# EAGLE board Arduino_fuer_LEDs_DCC_1.8.2 (EAGLE 9.6.2)
RELEASE_DATE: 21.12.22; RELEASE_VER: 1.8.2
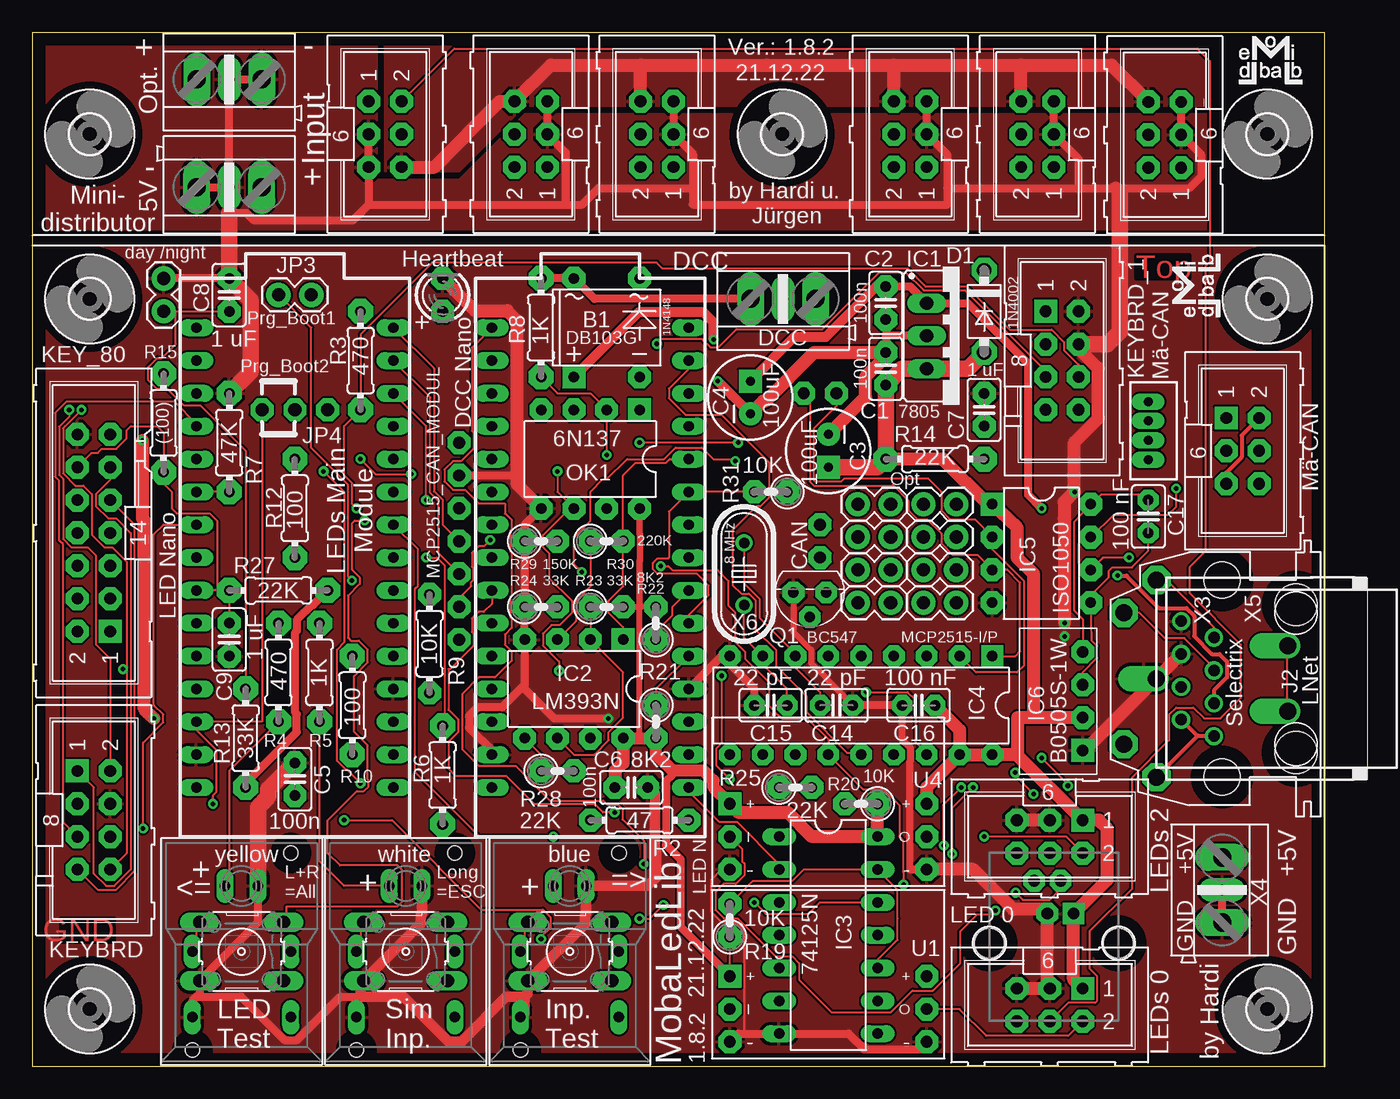
[diagram p2: board, top side]
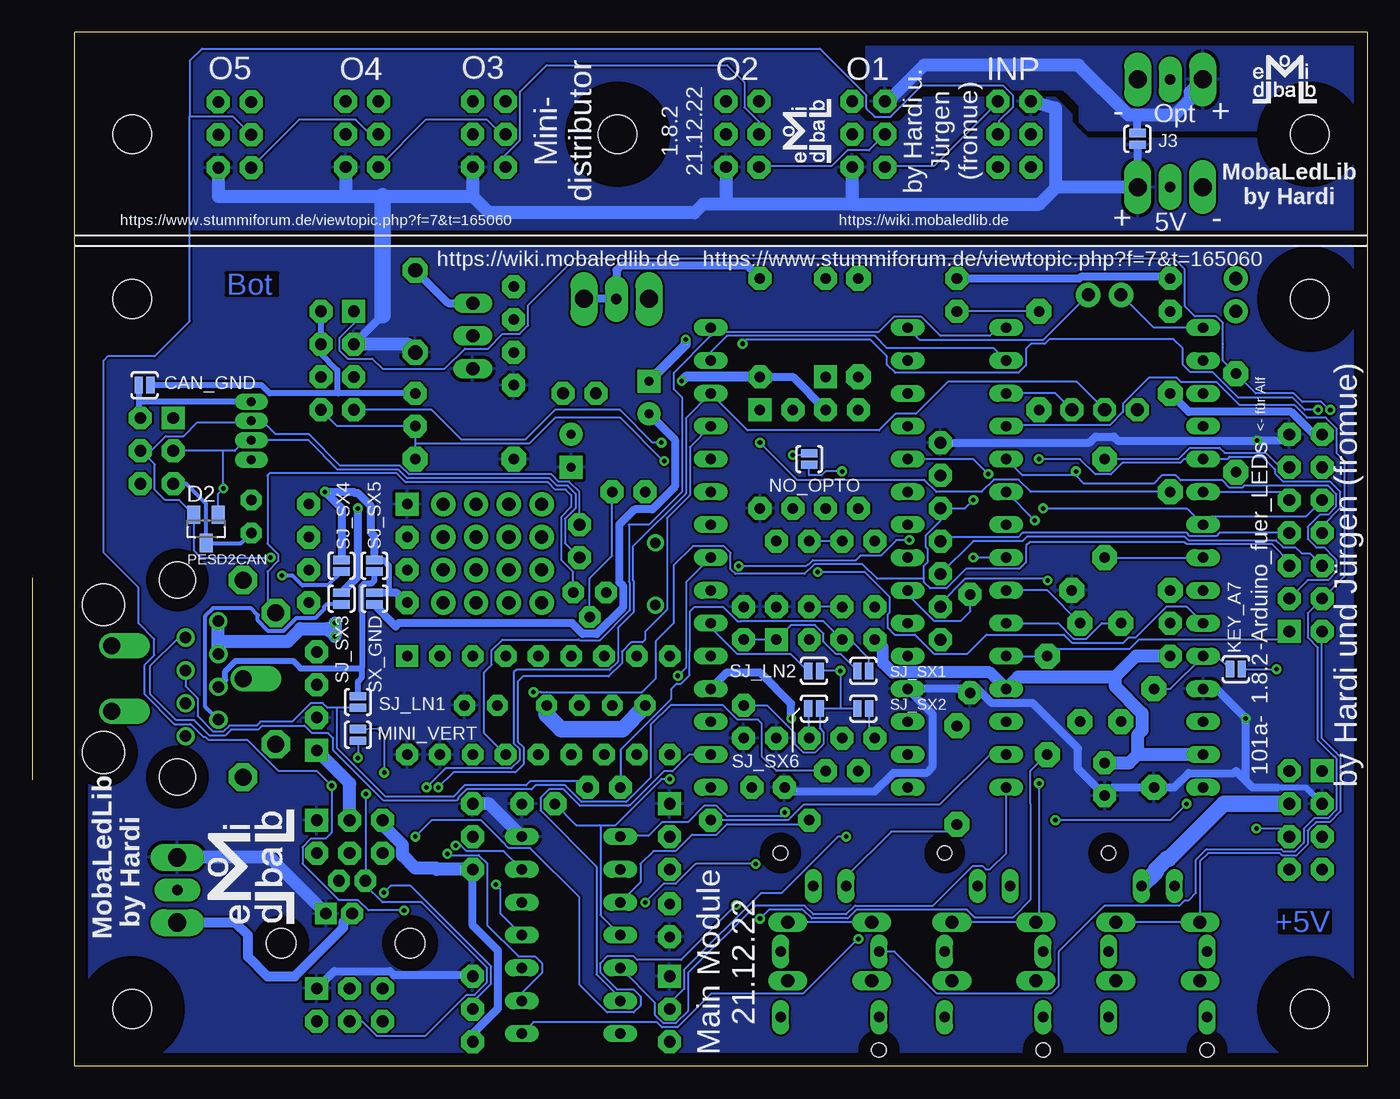
[diagram p3: board, bottom side, seen from below]

Size 100 x 80 mm. Coordinates in mm from the lower left corner, seen from the top.
Outline: 0,80 0,0 100,0 100,80 0,80
Copper layers (1*16): Top 0.035mm / dielectric 1.5mm / Bottom 0.035mm
Design rules "default *": minimum track width 6mil, minimum drill 0.35mm, track to track 6mil, track to pad 6mil, pad to pad 6mil, via to via 6mil, smd to smd 6mil, copper to edge 40mil, drill to drill 6mil, minimum pad ring 10mil, minimum via ring 8mil, stop-mask expansion 4mil, vias tented up to drill 0.5mm, thermal gap 10mil

## Footprints (pad centres in the part's own frame; a part is rotated, then mirrored left to right if it is on the bottom)
1X02 = drill 1.016 pad 1.88: 1 0,0; 2 2.54,0
DB = drill 0.813 pad 1.778 square: + -2.54,-3.81 | drill 0.813 pad 1.778 octagon: - 2.54,-3.81; AC1 2.54,3.81; AC2 -2.54,3.81
C025-025X050 = drill 0.813 pad 1.778 octagon: 1 -1.27,0; 2 1.27,0
SPARKFUN-CAPACITORS_CPOL-RADIAL-100UF-25V = drill 0.7 pad 1.778 square: 1 1.27,0 | drill 0.7 pad 1.778: 2 -1.27,0
C2.5-2 = drill 0.813 pad 1.6 octagon: 1 -1.27,0; 2 1.27,0
MCP2515_CAN_MODUL = drill 0.914 pad 1.778 octagon: 1 0,0; 2 0,-2.54; 3 0,-5.08; 4 0,-7.62; 5 0,-10.16; 6 0,-12.7; 7 0,-15.24; 8 27.94,-6.35; 9 27.94,-8.89; 10 26.67,3.81; 11 29.21,3.81
SJ_2S-NO = smd 0.635 x 1.27: 1 -0.45,0; 2 0.45,0
B4B-ZR4P = drill 0.7 pad 1.27 long: 1 0,0; 2 1.5,0; 3 3,0; 4 4.5,0
DO41-10 = drill 1.118 pad 1.93 octagon: A 3.175,0; C -3.175,0
SOT23 = smd 1 x 1.4: 1 -0.95,-1.1; 2 0.95,-1.1; 3 0,1.1
3,0 = hole 3: 0,0
78XXS = drill 1.016 long: GND 0,-2.54; IN -2.54,-2.54; OUT 2.54,-2.54
DIL08 = drill 0.813 pad 1.778 square: 1 -3.81,-3.81 | drill 0.813 pad 1.778 octagon: 2 -1.27,-3.81; 3 1.27,-3.81; 4 3.81,-3.81; 5 3.81,3.81; 6 1.27,3.81; 7 -1.27,3.81; 8 -3.81,3.81
DIL14 = drill 0.813 long: 1 -7.62,-3.81; 2 -5.08,-3.81; 3 -2.54,-3.81; 4 0,-3.81; 5 2.54,-3.81; 6 5.08,-3.81; 7 7.62,-3.81; 8 7.62,3.81; 9 5.08,3.81; 10 2.54,3.81; 11 0,3.81; 12 -2.54,3.81; 13 -5.08,3.81; 14 -7.62,3.81
DIL18 = drill 0.813 pad 1.676 square: 1 -10.16,-3.81 | drill 0.813 pad 1.676 octagon: 2 -7.62,-3.81; 3 -5.08,-3.81; 4 -2.54,-3.81; 5 0,-3.81; 6 2.54,-3.81; 7 5.08,-3.81; 8 7.62,-3.81; 9 10.16,-3.81; 10 10.16,3.81; 11 7.62,3.81; 12 5.08,3.81; 13 2.54,3.81; 14 0,3.81; 15 -2.54,3.81; 16 -5.08,3.81; 17 -7.62,3.81; 18 -10.16,3.81
DCDC-TEA_NME = drill 0.9 pad 1.778 square: G_IN 0,0 | drill 0.9 pad 1.778 octagon: G_OUT 5.08,0; V_IN 2.54,0; V_OUT 7.62,0
ML6 = drill 0.914 pad 1.778 octagon: 1 -2.54,-1.27; 2 -2.54,1.27; 3 0,-1.27; 4 0,1.27; 5 2.54,-1.27; 6 2.54,1.27
RJ11-NO_SHIELD_NO_MOUNT_HOULE = drill 0.9 pad 1.4: 1 -3.175,8.89; 2 -1.905,6.35; 3 -0.635,8.89; 4 0.635,6.35; 5 1.905,8.89; 6 3.175,6.35
1X03-CLEANBIG = drill 1.016 pad 1.778 octagon: 1 -2.54,0; 2 0,0; 3 2.54,0
ML14 = drill 0.914 pad 1.778 square: 1 -7.62,-1.27 | drill 0.914 pad 1.778 octagon: 2 -7.62,1.27; 3 -5.08,-1.27; 4 -5.08,1.27; 5 -2.54,-1.27; 6 -2.54,1.27; 7 0,-1.27; 8 0,1.27; 9 2.54,-1.27; 10 2.54,1.27; 11 5.08,-1.27; 12 5.08,1.27; 13 7.62,-1.27; 14 7.62,1.27
CON-HARTING-ML_ML08 = drill 0.914 pad 1.778 square: 1 -5.08,-1.27 | drill 0.914 pad 1.778 octagon: 2 -5.08,1.27; 3 -2.54,-1.27; 4 -2.54,1.27; 5 0,-1.27; 6 0,1.27; 7 2.54,-1.27; 8 2.54,1.27
LED3MM = drill 0.813 pad 1.778 octagon: A -1.27,0; K 1.27,0
TO92 = drill 0.813 pad 1.676 octagon: 1 1.27,0; 2 0,1.905; 3 -1.27,0
0204/7 = drill 0.813 pad 1.778 octagon: 1 -3.81,0; 2 3.81,0
0204/7' = drill 0.813 pad 1.93 octagon: 1 -3.81,0; 2 3.81,0
0207/2V = drill 0.813 pad 1.778 octagon: 1 -1.27,0; 2 1.27,0
B3F-10XX = drill 1.016 long: 1 -3.251,2.261; 2 3.251,2.261; 3 -3.251,-2.261; 4 3.251,-2.261
SRKL = drill 0.813 long: 1 -3.81,-5.08; 2 -3.81,0; 3 3.81,0; 4 3.81,-5.08; + -1.27,5.08; - 1.27,5.08 | hole 1.118: 3.81,7.62; -3.81,-7.62
ML6' = drill 0.914 pad 1.778 square: 1 -2.54,-1.27 | drill 0.914 pad 1.778 octagon: 2 -2.54,1.27; 3 0,-1.27; 4 0,1.27; 5 2.54,-1.27; 6 2.54,1.27
WS2812__BREAKOUT = drill 0.914 pad 1.778 square: 1 -7.62,2.54 | drill 0.914 pad 1.778 octagon: 2 -7.62,0; 3 -7.62,-2.54; 4 7.62,-2.54; 5 7.62,0; 6 7.62,2.54
NANO = drill 0.8 long: 3.3V -10.16,24.13; 5V -10.16,-1.27; A0 -10.16,19.05; A1 -10.16,16.51; A2 -10.16,13.97; A3 -10.16,11.43; A4 -10.16,8.89; A5 -10.16,6.35; A6 -10.16,3.81; A7 -10.16,1.27; AREF -10.16,21.59; D2 5.08,1.27; D3 5.08,3.81; D4 5.08,6.35; D5 5.08,8.89; D6 5.08,11.43; D7 5.08,13.97; D8 5.08,16.51; D9 5.08,19.05; D10 5.08,21.59; D11 5.08,24.13; D12 5.08,26.67; D13 -10.16,26.67; GND -10.16,-6.35; GND1 5.08,-1.27; RAW -10.16,-8.89; RST -10.16,-3.81; RST1 5.08,-3.81; RX1 5.08,-6.35; TX0 5.08,-8.89
RJ10 = drill 0.9 pad 1.676 square: 1 -1.524,-2.3 | drill 0.9 pad 1.676 octagon: 2 -0.508,-4.84; 3 0.508,-2.3; 4 1.524,-4.84 | hole 2.3: 5,0; -5,0
AK500/2+M = drill 1.397 long: 1 -2.515,0; 2 2.515,0 | drill 0.813 pad 1.778 long: M 0,0
MAB5SH = drill 1.321 pad 2.184 octagon: 1 7.62,5.08; 3 -7.62,5.08; 4 5.08,7.62; 5 -5.08,7.62 | drill 1.321 pad 1.626 offset: 2 0,5.08 | drill 1.321 offset: PE -2.54,-5.08; PE@ 2.54,-5.08 | hole 2.794: 7.62,0; -7.62,0
RJ45_MEBP8-8S = drill 0.889: 1 -4.445,6.35; 2 -3.175,8.89; 3 -1.905,6.35; 4 -0.635,8.89; 5 0.635,6.35; 6 1.905,8.89; 7 3.175,6.35; 8 4.445,8.89 | hole 3.251: -5.715,0; 5.715,0
HC49U-V = drill 0.813: 1 -2.413,0; 2 2.413,0

## Placement (x,y rotation side)
A1  Opt  [1X02]  63.88,35.88 0 top
A2  Opt  [1X02]  68.96,35.88 0 top
A3  Opt  [1X02]  68.96,38.42 0 top
A4  Opt  [1X02]  63.88,38.42 0 top
A5  Opt  [1X02]  68.96,40.96 0 top
A6  Opt  [1X02]  63.88,40.96 0 top
A7  Opt  [1X02]  68.96,43.5 0 top
A8  Opt  [1X02]  63.88,43.5 0 top
B1  DB103G  [DB]  44.45,57.15 0 top
C1  100n  [C025-025X050]  66.04,53.98 90 top
C2  100n  [C025-025X050]  66.04,59.05 270 top
C3  100uF  [SPARKFUN-CAPACITORS_CPOL-RADIAL-100UF-25V]  61.59,47.62 270 top
C4  100uF  [SPARKFUN-CAPACITORS_CPOL-RADIAL-100UF-25V]  55.56,51.75 90 top
C5  100n  [C025-025X050]  20.32,22.23 90 top
C6  100n  [C025-025X050]  46.35,21.59 0 top
C7  1 uF  [C025-025X050]  73.66,50.8 90 top
C8  1 uF  [C025-025X050]  15.24,59.69 90 top
C9  1 uF  [C025-025X050]  15.24,33.02 270 top
C14  22 pF  [C2.5-2]  62.23,27.94 0 top
C15  22 pF  [C2.5-2]  57.15,27.94 180 top
C16  100 nF  [C2.5-2]  68.58,27.94 180 top
C17  100 nF  [C2.5-2]  86.36,42.55 270 top
CAN2  MCP2515_CAN_MODUL  [MCP2515_CAN_MODUL]  33.02,48.26 0 top
CAN_GND  SOLDERJUMPERNO  [SJ_2S-NO]  94.61,52.7 0 bottom
CON5  M04B4B-ZR4P  [B4B-ZR4P]  86.36,51.44 270 top
D1  1N4002  [DO41-10]  73.66,58.42 270 top
D2  PESD2CAN  [SOT23]  89.85,41.59 180 bottom
H1  MOUNT-HOLE3.0  [3,0]  4.45,4.45 0 top
H2  MOUNT-HOLE3.0  [3,0]  4.45,59.37 0 top
H3  MOUNT-HOLE3.0  [3,0]  95.57,59.37 0 top
H4  MOUNT-HOLE3.0  [3,0]  95.57,4.45 0 top
H5  MOUNT-HOLE3.0  [3,0]  4.45,72.12 0 top
H6  MOUNT-HOLE3.0  [3,0]  95.57,72.12 0 top
H7  MOUNT-HOLE3.0  [3,0]  58.02,72.12 0 top
IC1  7805  [78XXS]  71.75,56.52 270 top
IC2  LM393N  [DIL08]  41.91,29.21 180 top
IC3  74125N  [DIL14]  61.59,10.16 270 top
IC4  MCP2515-I/P  [DIL18]  64.14,27.94 180 top
IC5  ISO1050  [DIL08]  78.11,39.69 270 top
IC6  B0505S-1W  [DCDC-TEA_NME]  81.28,24.45 90 top
INP  [ML6]  27.3,72.12 270 top
J1  day /night  [1X02]  10.16,60.96 270 top
J2  LNet  [RJ11-NO_SHIELD_NO_MOUNT_HOULE]  97.79,30 90 top
J3  SOLDERJUMPERNO  [SJ_2S-NO]  17.78,71.75 90 bottom
JP3  Prg_Boot1  [1X02]  21.59,59.69 180 top
JP4  Prg_Boot2  [1X03-CLEANBIG]  20.32,50.8 0 top
KEY_80  [ML14]  4.76,41.27 90 top
KEY_A7  SOLDERJUMPERNO  [SJ_2S-NO]  10.16,30.73 0 bottom
KEYBRD  [CON-HARTING-ML_ML08]  4.76,17.78 270 top
KEYBRD_1  [CON-HARTING-ML_ML08]  79.69,53.34 270 top
LED1  Heartbeat  [LED3MM]  31.75,59.69 90 top
MINI_VERT  SOLDERJUMPERNO  [SJ_2S-NO]  78.11,25.65 90 bottom
NO_OPTO  SOLDERJUMPERNO  [SJ_2S-NO]  43.18,46.99 90 bottom
O1  [ML6]  38.59,72.12 90 top
O2  [ML6]  48.34,72.12 90 top
O3  [ML6]  67.94,72.12 90 top
O4  [ML6]  77.79,72.12 90 top
O5  [ML6]  87.63,72.07 90 top
OK1  6N137  [DIL08]  43.18,46.99 180 top
Q1  BC547  [TO92]  60.17,36.67 180 top
R2  47  [0204/7]  46.99,19.05 0 top
R3  470  [0204/7']  25.4,54.61 270 top
R4  470  [0204/7']  19.05,30.48 90 top
R5  1K  [0204/7']  22.23,30.48 90 top
R6  1K  [0204/7']  31.75,22.54 90 top
R7  47K  [0204/7']  15.24,48.26 270 top
R8  1K  [0204/7']  39.37,57.15 90 top
R9  10K  [0204/7]  30.73,32.7 270 top
R10  100  [0204/7']  24.77,27.94 90 top
R12  100  [0204/7']  20.32,43.18 90 top
R13  33K  [0204/7']  16.51,25.4 270 top
R14  22K  [0204/7']  69.85,46.99 180 top
R15  (100)  [0204/7']  10.16,49.78 90 top
R19  10K  [0207/2V]  53.98,11.3 90 top
R20  10K  [0207/2V]  64.14,20.32 180 top
R21  8K2  [0207/2V]  48.26,26.67 270 top
R22  8K2  [0207/2V]  48.26,34.29 90 top
R23  33K  [0207/2V]  44.45,35.56 0 top
R24  33K  [0207/2V]  39.37,35.56 0 top
R25  22K  [0207/2V]  59.05,21.59 0 top
R27  22K  [0204/7']  19.05,36.83 0 top
R28  22K  [0207/2V]  40.64,22.86 0 top
R29  150K  [0207/2V]  39.37,40.64 0 top
R30  220K  [0207/2V]  44.45,40.64 0 top
R31  10K  [0207/2V]  57.15,44.45 180 top
S1  [B3F-10XX]  16.19,8.89 180 top
S2  [B3F-10XX]  28.89,8.89 180 top
S3  [B3F-10XX]  41.59,8.89 180 top
S4  yellow  [SRKL]  16.19,8.89 0 top
S5  white  [SRKL]  28.89,8.89 0 top
S6  blue  [SRKL]  41.59,8.89 0 top
SJ_LN1  SOLDERJUMPERNO  [SJ_2S-NO]  78.11,28.19 270 bottom
SJ_LN2  SOLDERJUMPERNO  [SJ_2S-NO]  42.8,30.61 180 bottom
SJ_SX1  SOLDERJUMPERNO  [SJ_2S-NO]  38.99,30.61 180 bottom
SJ_SX2  SOLDERJUMPERNO  [SJ_2S-NO]  38.99,27.69 180 bottom
SJ_SX3  SOLDERJUMPERNO  [SJ_2S-NO]  79.38,36.2 90 bottom
SJ_SX4  SOLDERJUMPERNO  [SJ_2S-NO]  79.38,38.73 90 bottom
SJ_SX5  SOLDERJUMPERNO  [SJ_2S-NO]  76.83,38.73 90 bottom
SJ_SX6  SOLDERJUMPERNO  [SJ_2S-NO]  42.8,27.69 0 bottom
SV1  Mä-CAN  [ML6']  93.66,47.62 270 top
SV2  LEDs 2  [ML6']  78.74,17.78 180 top
SV3  LEDs 0  [ML6']  78.74,4.76 180 top
SX_GND  SOLDERJUMPERNO  [SJ_2S-NO]  76.83,36.2 90 bottom
U1  WS2812_BREAKOUT  [WS2812__BREAKOUT]  61.59,4.45 0 top
U2  LED NANO  [NANO]  22.86,30.48 0 top
U3  DCC NANO  [NANO]  45.72,30.48 0 top
U4  WS2812_BREAKOUT  [WS2812__BREAKOUT]  61.59,17.78 0 top
U$1  ESP_ADAPTER  [ESP_ADAPTER]  12.7,21.59 0 top
X1  RJ10  [RJ10]  79.06,9.53 180 top
X2  AK500/2+M  [AK500/2+M]  58.1,59.37 180 top
X3  MAB 5SH Conrad: 738247 - VQ  [MAB5SH]  92.08,30 90 top
X4  AK500/2+M  [AK500/2+M]  92.08,13.65 90 top
X5  Reichelt MEBP 8-8S  [RJ45_MEBP8-8S]  97.79,30 90 top
X6  8 MHz  [HC49U-V]  55.09,38.1 270 top
X7  AK500/2+M  [AK500/2+M]  15.24,76.35 180 top
X9  AK500/2+M  [AK500/2+M]  15.24,68.02 0 top

## Tracks (layer width: path | path; a pad name or v marks a point on that pad's centre or on a via)
+5V  (via drill 0.35)
  Top 0.152: U1.1 R19.1
  Top 0.457: 46.99,25.4 46.99,35.56 | R22.2 46.99,35.56 | R23.2 46.99,35.56
  Top 0.508: OK1.8 46.99,41.2 47.02,41.18 47.02,39.13 46.99,39.11 46.99,35.56
  Top 0.61: R27.2 21.74,35.71 21.64,35.71 20.47,34.55 20.47,33.7 20.32,33.55 20.32,27.41 20.47,27.26 20.47,25.87 16.51,21.91 R13.2 | 49.53,22.86 49.53,22.55 49.03,22.05 49.03,17.14 50.16,16.02 50.16,10.79 U1.1
  Top 0.914: U4.1 52.72,21.58 52.72,22.11 51.97,22.86 49.53,22.86 48.26,24.13 R21.2 46.99,25.4 IC2.8
  Top 1.016: C16.1 71.75,26.04 IC4.17 | IC4.17 IC4.18 76.2,24.13 | U4.1 54.66,19.63 58.46,19.63 60.31,17.78 IC3.14 R20.1 | C6.1 45.09,22.86 45.72,23.5 IC2.8 | R14.2 70.48,46.99 73.98,43.5 IC5.1 76.17,41.7 76.2,41.67 76.2,39.37 77.47,38.1 77.47,26.99 | IC6.V_IN 77.47,26.99 | 77.47,26.99 76.24,26.99 76.24,24.17 76.2,24.13 | 76.2,24.13 SV2.1 82.55,19.05 83.19,18.41 83.19,14.43 X1.1 80.58,6.73 SV3.1 | U4.6 69.22,21.59 IC4.17 | v8.51,48.42 8.51,42.38 8.67,42.22 8.67,27.65 v9.4,26.92
  Top 1.27: C3.1 65.41,46.35 R14.2 C1.1 67.31,53.98 IC1.OUT 72.39,53.98 D1.A
  Bottom 0.152: 79.06,67.67 79.1,67.67 78.87,67.31
  Bottom 0.457: KEYBRD.3 4.76,21.59 6.99,21.59
  Bottom 0.61: CAN2.1 21.49,48.26 21.04,48.72 19.61,48.72 19.31,48.42 v8.51,48.42 6.51,48.42 KEY_80.13 | U2.5V 11.68,29.21 v9.4,26.92 9.4,22.1 | 9.4,22.1 10.16,22.86 10.32,22.7 13.81,22.7 14.93,21.59 R13.2 19.68,21.59 C5.1 22.38,23.02 22.38,24.61 25.88,28.1 29.05,28.1 30.44,29.48 R9.2 30.8,29.21 U3.5V 33.66,27.3 33.66,23.18 34.13,22.7 36.67,22.7 38.1,21.27 44.77,21.27 C6.1 | 9.4,22.1 8.89,21.59 6.99,21.59 | SV3.1 79.93,7.38 75.64,7.38 75.32,7.05 69.28,7.05 U1.6 | J3.1 17.78,69.85 17.75,69.88 X9.2 | KEYBRD_1.3 76.2,58.1
  Bottom 1.016: X1.1 84.92,16.17 X4.2 | IC3.14 67.94,20.32 U4.6 | D1.A 74.3,55.88 KEYBRD_1.3 | 39.86,66.71 25.36,66.71 24.13,67.94 | 78.87,67.31 76.2,67.31 69.22,67.31 | 39.86,66.71 49.62,66.71 | INP.1 24.13,74.14 24.13,67.94 | O1.1 39.86,66.71 | O2.1 49.62,66.71 | O3.1 69.22,67.31 | O4.1 79.06,67.67 79.06,67.31 88.9,67.31 O5.1 | X9.2 24.05,68.02 24.13,67.94 | 49.62,66.71 51.4,66.71 52.07,66.04 67.94,66.04 69.22,67.31
  Bottom 1.27: 76.2,58.1 76.2,67.31
  pour Bottom: 0,62.23 1.27,63.5 1.91,63.5 97.16,63.5 100.33,60.33 100.33,2.54 97.79,0 1.91,0 0,1.91 0,2.54
  pour Bottom: 0,71.75 21.59,71.75 22.23,72.39 22.86,73.03 22.86,73.66 24.13,74.93 34.29,74.93 36.2,73.03 36.83,73.03 38.73,73.03 39.37,73.66 39.37,80.01 99.69,80.01 99.69,64.77 0,64.77
A1  (via drill 0.35)
  Top 0.152: v25.4,46.99 26.56,45.83 v29.32,45.83
  Bottom 0.152: v29.32,45.83 30.48,46.99 U3.A1 | v25.4,46.99 22.23,46.99 21.03,45.8 19.83,45.8 18.94,46.69 14.48,46.69 14.17,46.99 U2.A1 10.83,46.99 10.65,47.17 8.1,47.17 7.15,46.22 7.15,45.89 6.5,45.24 2.86,45.24 2.07,44.45 2.07,43.23 3.49,41.8 KEY_80.8
A7
  Top 0.152: J1.2 11.11,58.42 | 11.11,58.42 C8.1 | R13.1 16.51,47.62 13.02,51.12 11.75,51.12 10.47,52.4 9.67,52.4 8.97,53.1 8.97,54.09 9.67,54.79 10.02,54.79 11.11,55.88 11.11,58.42
  Bottom 0.152: R13.1 15.24,29.21 U2.A7 11.63,31.75 KEY_A7.1
BUTTONS  (via drill 0.35)
  Top 0.152: KEYBRD.7 5.08,13.65 6.35,13.65 6.36,13.66 6.48,13.66 7.94,15.13 7.94,41.91 KEY_80.9 | R7.2 U2.A2 | v54.61,48.26 52.43,48.26 49.21,48.26 v46.99,48.26
  Bottom 0.152: KEY_80.9 6.67,44.45 U2.A2 | R7.2 26.04,44.45 26.99,45.4 28.89,45.4 29.84,44.45 33.34,44.45 34.29,45.4 44.13,45.4 v46.99,48.26 | v54.61,48.26 55.3,48.26 57.84,50.8 62.87,50.8 65.18,48.49 70.08,48.49 72.39,50.8 KEYBRD_1.7
CAN_H  (via drill 0.35)
  Top 0.152: IC5.7 83.69,42.67 87.88,42.67 88.52,43.31 v88.52,44.7
  Bottom 0.152: CAN2.9 62.08,40.49 62.08,42.37 61.27,43.19 61.27,44.32 61.87,44.93 62.7,44.93 63.26,45.49 74.28,45.49 74.97,46.18 79.66,46.18 81.92,48.44 CON5.3 86.82,48.44 87.63,47.62 88.52,47.62 | 88.52,47.62 SV1.3 | 88.52,47.62 v88.52,44.7 88.9,44.32 D2.1
CAN_L  (via drill 0.35)
  Top 0.152: v84.86,39.37 82.83,39.37 82.77,39.31 82.77,39.27 IC5.6
  Bottom 0.152: 94.49,47.24 94.79,47.55 SV1.4 94.49,47.24 | 94.49,47.24 92.96,48.77 91.59,48.77 90.53,49.84 86.41,49.84 CON5.2 85.5,49.94 84.45,48.9 81.89,48.9 79.48,46.48 74.84,46.48 74.15,45.8 63.14,45.8 62.58,45.24 61.75,45.24 60.96,44.45 CAN2.8 | 94.49,47.24 93.81,46.57 93.81,44.6 93.03,43.81 91.92,43.81 D2.2 90.8,39.92 90.25,39.37 v84.86,39.37
CAN_VCC
  Top 0.152: C17.1 85.83,44.21 82.69,44.21 IC5.8 80.61,42.11 80.61,35.29 81.28,34.61 IC6.V_OUT
CLOCK_K
  Top 0.152: U2.A0 12.7,49.74 11,51.44 2.63,51.44 1.76,50.57 1.76,45.63 2.07,45.33 2.07,40.69 2.38,40.38 2.38,18.9 KEYBRD.5
D2
  Bottom 0.152: KEY_80.1 6.67,33.02 17.67,33.02 18.4,32.28 24.23,32.28 R10.2 U2.D2
D2_2  (via drill 0.35)
  Top 0.152: v40.64,46.04 40.64,44.45 OK1.6 41.6,43.18 39.52,41.1 39.52,40.18 40.01,39.69 40.01,37.78 41.76,36.02 41.76,35.1 40.8,34.14 40.18,34.14 39.52,33.48 39.52,32.56 40.77,31.31 v40.77,30.61 | U3.D2 48.26,29.21 R21.1
  Bottom 0.152: v40.64,46.04 41.91,46.04 42.23,45.72 43.18,45.72 NO_OPTO.1 | SJ_SX2.2 40.77,27.69 | 40.77,27.69 SJ_SX6.2 42.35,26.15 42.06,25.86 42.06,24.94 42.72,24.28 43.64,24.28 44.33,24.96 44.33,25.81 46.45,27.94 R21.1 | SJ_LN2.1 v40.77,30.61 40.77,27.69
D3
  Bottom 0.152: R4.2 20.54,34.29 21.73,33.1 22.72,33.1 23.91,34.29 U2.D3
D4
  Bottom 0.152: R5.2 24.77,36.83 U2.D4
D5  (via drill 0.35)
  Top 0.152: R6.2 31.9,26.5 31.9,38.79 31.32,39.37 v30.48,39.37
  Bottom 0.152: U2.D5 v30.48,39.37
D6  (via drill 0.35)
  Top 0.152: U2.D6 29.84,40.01 29.84,37.2 29.62,36.98 29.62,22.77 34.61,17.78 v40.32,17.78
  Bottom 0.152: U1.2 53.98,4.88 52.86,6 52.86,7.47 46.92,13.41 45.34,13.41 40.97,17.78 v40.32,17.78
D7  (via drill 0.35)
  Top 0.152: S4.2 12.7,9.21 12.7,11.11 S1.4 | S1.3 19.68,11.43 19.68,12.38 28.26,12.38 28.57,12.7 28.57,15.24 28.26,15.56 23.81,15.56 22.86,16.51 22.86,19.05 25.11,21.3 25.65,21.3 26.01,21.66 26.01,22.16 25.96,22.21 25.96,24.84 24.89,25.91 24.89,30.19 25.96,31.26 25.96,32.24 25.26,32.94 24.64,32.94 24.43,33.15 24.43,36.43 25.34,37.34 25.34,37.84 24.75,38.44 24.75,42.04 24.94,42.23 v25.72,42.23
  Bottom 0.152: v25.72,42.23 U2.D7 | S1.3 S1.4 12.94,15.88 12.31,16.51 6.77,16.51 6.62,16.36 5.44,16.36 4.61,17.19 4.61,18.25 4.45,18.41 4.44,18.41 3.96,18.9 2.9,18.9 2.07,19.73 2.07,23.97 2.38,24.28 2.39,24.28 3.5,25.4 3.5,33.64 KEY_80.2
D8  (via drill 0.35)
  Top 0.152: S5.2 25.4,9.21 25.4,11.11 S2.4 | v22.54,46.04 24.13,44.45 24.13,32.8 23.57,32.24 23.57,23.64 24.27,22.94 24.37,22.94 v25.4,21.91
  Bottom 0.152: U2.D8 26.67,45.72 22.54,45.72 | v25.4,21.91 25.4,11.43 S2.4 S2.3 | 22.54,45.72 v22.54,46.04 | KEY_80.3 4.61,37.62 3.03,37.62 2.38,38.27 2.38,39.2 2.54,39.36 2.54,39.37 3.33,40.16 3.96,40.16 4.61,40.81 4.61,41.74 4.45,41.9 4.45,41.91 3.66,42.7 3.03,42.7 2.38,43.35 2.38,44.28 3.03,44.93 9.51,44.93 9.67,44.78 10.65,44.78 11.21,45.33 14.43,45.33 14.82,45.72 15.88,45.72 16.51,45.09 21.91,45.09 22.54,45.72
D9
  Top 0.152: S6.2 38.1,9.21 38.1,11.11 S3.4
  Bottom 0.152: S6.2 36.57,8.89 33.32,5.64 24.47,5.64 23.89,6.22 23.89,8.87 20.34,12.42 14.55,12.42 14.12,12.85 13.82,12.85 13.25,13.42 13.25,16 12.43,16.82 6.65,16.82 6.5,16.66 5.57,16.66 4.92,17.32 4.92,18.38 4.09,19.2 3.03,19.2 2.38,19.86 2.38,23.84 2.51,23.98 2.54,23.98 3.81,25.25 3.81,32.39 4.61,33.19 4.61,35.08 KEY_80.4 1.76,37.92 1.76,46.85 2.38,47.46 2.38,49.36 3.17,50.16 4.64,50.16 5.65,51.17 9.9,51.17 11.68,52.95 14.43,52.95 14.75,53.26 16.9,53.26 18.9,51.26 18.9,50.64 19.93,49.61 27.86,49.61 U2.D9 | S3.4 S3.3
D10  (via drill 0.35)
  Top 0.152: U2.D10 30.48,49.53 v30.48,43.81 | IC4.16 69.22,24.26 68.34,25.13 68.34,28.37 67.74,28.97 66.88,28.97 66.87,28.96 v64.52,28.96
  Bottom 0.152: U2.D10 24.13,52.07 JP4.3 | v30.48,43.81 31.11,43.18 CAN2.3 33.02,42.22 34.14,41.1 34.14,40.18 34.02,40.06 34.02,39 34.29,38.74 34.29,37.78 | 34.29,37.78 34.29,37.47 33.81,36.98 32.56,36.98 31.05,38.49 26.92,38.49 26.67,38.73 26.4,39 26.4,40.27 26.11,40.56 14.12,40.56 13.97,40.42 7.4,40.42 6.03,39.05 KEY_80.5 | 34.29,37.78 34.36,37.71 37.92,37.71 39.06,38.86 42.77,38.86 43.53,38.1 48.9,38.1 49.26,38.47 49.26,39.74 49.78,40.25 52.19,40.25 53.67,38.77 53.67,34.29 55.04,32.92 55.04,30.05 56.12,28.97 63.5,28.97 63.93,28.97 64.5,28.97 v64.52,28.96
D11
  Top 0.152: CAN2.5 31.43,39.69 31.43,43.72 30.79,44.37 30.79,51.77 U2.D11 | IC4.14 64.01,24.23 63.09,24.23 59.89,27.43 59.89,28.65 57.58,30.96 57.58,32.19 55.98,33.8 55.98,36.05 55.45,36.58 54.86,36.58 54.2,37.24 54.2,41.5 56.03,43.33 56.34,43.33 57,43.99 57,46.73 53.32,50.41 50.55,50.41 49.26,51.7 49.26,52.44 50.8,53.97 U3.D11
  Bottom 0.152: U2.D11 28.89,55.56 37.15,55.56 38.1,56.52 49.53,56.52 50.8,55.24 U3.D11 | KEY_80.6 4.45,39.69 5.08,39.69 5.55,40.16 6.5,40.16 7.06,40.72 13.85,40.72 14.09,40.97 26.34,40.97 26.67,40.64 30.48,40.64 CAN2.5
D12
  Top 0.152: CAN2.4 31.75,41.91 31.75,43.83 31.09,44.49 31.09,54 U2.D12
  Bottom 0.152: CAN2.4 32.7,40.96 26.99,40.96 26.67,41.27 13.97,41.27 13.72,41.03 11.68,41.03 11.43,41.27 KEY_80.7 | U2.D12 28.57,57.15 29.21,56.52 33.02,56.52 34.54,58.03 36.58,58.03 37.77,56.84 50.49,56.84 U3.D12 50.8,56.51 53.65,53.67 53.65,52.38 53.03,51.76 53.03,44.45 55.57,41.91 57.13,41.91 57.14,41.9 57.14,37.5 57.07,37.43 57.07,35.28 59.41,32.94 60.92,32.94 61.01,33.02 66.91,33.02 67.74,32.19 67.74,31.08 68.34,30.48 68.34,25.79 IC4.15
D13  (via drill 0.35)
  Top 0.152: JP3.2 21.59,57.15 21.59,47.85 24.43,45 24.43,44.46 24.45,44.45 24.45,37.88 v24.74,37.59 | CAN2.6 33.07,35.66 33.07,36.27 33.96,37.16 33.96,37.46 34.14,37.64 34.14,38.56 34.02,38.68 34.02,39.74 34.54,40.25 34.96,40.25 v35.43,40.73 | v48.64,38.71 49.23,38.71 49.53,38.41 53.03,38.41 53.89,37.55 53.89,35.62 54.41,35.1 54.41,32.82 55.17,32.06 55.17,31.55 57,29.72 57,27.89 57.68,27.2 57.7,27.2 57.99,26.91 59.98,26.91 61.59,25.3 IC4.13 64.29,21.44 65.87,21.44 67.08,20.22 67.08,17.78 67.39,17.48 67.39,15.04 67.42,15.01 v67.42,14.08
  Bottom 0.152: U2.D13 16.51,57.15 JP3.2 | CAN2.6 33.02,35.81 31.11,37.71 24.86,37.71 v24.74,37.59 | v48.64,38.71 43.43,38.71 43.29,38.85 43.21,38.85 42.9,39.16 39.58,39.16 39.22,39.52 37.64,39.52 36.43,40.73 v35.43,40.73 | IC3.11 67.08,11.84 67.08,13.74 v67.42,14.08
D37_2
  Top 0.152: U3.D3 50.8,34.93 52.34,36.46 52.34,37.2 51.43,38.1 48.39,38.1 48.03,38.45 48.03,38.96 48.39,39.31 49.21,39.31 49.26,39.37 49.26,42.91 U3.D7 R31.2
  Bottom 0.152: U3.D3 50.8,33.98 48.72,31.9 44.6,31.9 43.31,30.61 SJ_LN2.2
D48_2
  Top 0.152: IC2.1 45.72,33.98 44.6,35.1 44.6,36.02 45.72,37.14 R30.2 45.72,45.72 46.69,46.69 49.02,46.69 49.33,46.99 U3.D8 | U3.D4 49.53,35.56 49.53,34.92 48.26,33.66 R22.1
  Bottom 0.152: SJ_SX1.2 40.73,31.9 41.1,31.9 42.06,32.86 42.06,33.48 42.72,34.14 44.6,34.14 IC2.1 R22.1
DCC/SX_GND  (via drill 0.35)
  Top 0.61: C2.2 66.04,56.52 | 66.04,56.52 C1.2 | IC1.GND 66.04,56.52
  Top 0.762: v53.03,53.03 54.14,51.93 54.14,51.91 C4.2
  Top 1.016: C4.2 56.55,51.47 56.73,51.47 60.5,55.24 C1.2 66.04,54.9 64.49,53.35 64.49,51.79 C3.2
  Bottom 0.61: B1.- 44.45,53.34 OK1.3 | C4.2 53.57,48.49 53.57,44.86 55.32,43.1 56.69,43.1 57.89,41.91 57.89,37.49 57.6,37.21 57.6,35.5 59.63,33.47 60.7,33.47 61.52,34.29 74.93,34.29 75.17,34.05 SX_GND.1
  Bottom 0.762: B1.- 52.73,53.34 v53.03,53.03
DT0  (via drill 0.35)
  Top 0.152: U1.5 71.75,4.45 73.83,2.38 80.16,2.38 SV3.2 | v76.09,13.45 76.64,12.89 78.74,12.89 79.57,13.72 X1.2
  Bottom 0.152: U1.5 69.22,4.97 67.79,6.4 67.79,7.75 74.02,13.97 75.56,13.97 v76.09,13.45
GND  (via drill 0.35)
  Top 0.152: 38.42,6.67 S3.2 | 55.12,2.54 55.09,2.56 55.09,10.5 54.44,11.15 53.34,11.15 52.55,11.94 52.55,14.45 53.34,15.24 U4.3
  Top 0.457: C14.2 61.42,30.02 61.42,30.06 60.27,31.2 60.27,32.26 58.9,33.63 Q1.1
  Top 0.559: C16.2 67.31,25.29 67.94,24.66 67.94,23.6 67.89,23.55 67.89,15.29 67.94,15.24
  Top 0.61: S4.1 12.38,5.08 12.7,5.4 | 12.7,5.4 12.94,5.64 S1.2 17.46,11.15 S4.- | 12.7,5.4 16.17,5.4 19.54,2.03 20.46,2.03 23.83,5.4 25.4,5.4 | OK1.5 38.1,41.91 R29.1 R24.1 IC2.4 38.1,29.52 37.94,29.37 | 37.94,29.37 36.36,27.78 34.45,27.78 33.8,27.13 33.8,26.21 35.56,24.45 U3.GND | C8.2 J1.1 | CAN2.2 37.53,45.72 | O2.5 O2.3 51.12,70.62 51.12,67.94 | O3.5 O3.3 70.8,70.53 70.8,67.94 | O4.5 O4.3 80.96,70.22 80.96,67.94 | O5.5 O5.3 90.49,70.48 90.49,68.9 89.53,67.94 83.82,67.94 80.96,67.94 | O1.5 O1.3 41.27,70.7 41.27,66.67 | 51.12,67.94 43.81,67.94 42.55,66.67 41.27,66.67 | 70.8,67.94 80.96,67.94 | 70.8,67.94 70.8,66.67 51.12,66.67 51.12,67.94 | 26.04,66.67 INP.5 INP.3 | 26.04,66.67 41.27,66.67 | 69.85,15.24 U4.4 67.94,15.24 | C16.2 C14.2 | C15.2 55.88,29.21 53.98,31.11 IC4.9 53.34,31.75 U3.GND1 | X4.1 X4.M | U1.3 54.61,2.54 55.12,2.54 IC3.7 63.16,2.54 64.38,1.32 68.63,1.32 U1.4 | 37.94,29.37 40.39,26.92 v44.58,26.92 | X9.1 X9.M | X9.M 15.24,66.04 16.56,66.04 17.13,65.47 24.83,65.47 26.04,66.67 | X9.M X7.M X7.1
  Top 0.813: 38.42,6.67 42.76,11.01 42.76,11.7 42.86,11.8 S6.- 47.62,13.97 48.26,14.61 48.26,16.7 48.17,16.79 48.17,21.04 C6.2 | S3.2 38.34,5.64 38.1,5.4 | 38.1,5.4 38.1,4.13 S6.1 | 38.1,5.4 36.67,5.4 33.21,1.93 32.2,1.93 28.73,5.4 25.4,5.4 | S5.1 25.08,5.08 25.4,5.4 | 25.4,5.4 25.4,6.39 S2.2 30.06,11.05 30.06,11.7 30.16,11.8 S5.-
  Top 1.016: LED1.K 34.25,58.46 36.76,58.46 37.53,57.69 37.53,45.72 37.53,45.02 OK1.5 | v79.87,34.29 79.87,42.1 79.86,42.39 79.86,43.67 v80.64,44.45 80.64,48.29 82.51,50.16 82.51,53.98 80.96,55.53 KEYBRD_1.4 | J2.5 X3.2 81.44,24.45 IC6.G_IN | SV2.3 SV2.5 | SV3.5 SV3.3 78.55,6.22 X1.3 78.22,12.15 75.91,12.15 72.83,15.24 69.85,15.24 | 83.82,67.94 84.15,67.61
  Top 1.27: R7.1 16.92,53.75 16.92,59.28 C8.2 15.24,66.04 | C5.2 18.26,21.44 18.26,20.86 17.46,20.06 S4.- | 84.15,67.61 84.15,56.85 83.19,55.88 KEYBRD_1.4
  Bottom 0.152: KEY_80.14 3.81,48.9
  Bottom 0.406: SJ_SX5.2 76.14,39.19 75.69,38.73 75.69,36.67
  Bottom 0.457: C7.2 79.63,52.07 | 79.63,52.07 84.92,52.07 85.56,52.7 CAN_GND.2 | 79.63,52.07 79.69,52.13 79.69,53.87 80.96,55.14 KEYBRD_1.4 KEYBRD_1.2
  Bottom 0.61: LED1.K 22.3,60.96 22.17,61.09 15.37,61.09 C8.2 | R7.1 13.81,50.64 5.88,50.64 4.13,48.9 3.81,48.9 | U4.4 69.22,10.91 67.26,8.96 67.26,4.5 69.22,2.54 U1.4 | v44.58,26.92 44.58,28.07 46.99,30.48 49.53,30.48 U3.GND1 | SX_GND.2 76.2,36.66 75.69,36.67 75.15,36.68 IC5.4 | SJ_SX4.2 79.38,43.18 v80.64,44.45 78.4,44.45 78.32,44.38 78.12,44.38 77.1,43.36 77.1,41.32 76.83,41.05 SJ_SX5.2
  Bottom 0.762: X1.3 79.21,11.16 79.21,10.77 83,6.98 85.11,6.98 86.61,8.47 86.61,10.16 87.58,11.14 X4.1
  Bottom 0.914: U2.GND1 29.22,30.49 36.74,30.49 37.48,31.23 37.48,32.4 IC2.4
  Bottom 1.016: C9.2 17.89,31.75 19.52,30.12 | U2.GND1 27.03,30.12 19.52,30.12 | 19.52,30.12 19.52,29.44 17.42,27.34 17.42,26 17.78,25.64 17.78,24.13 | C5.2 18.41,23.5 17.78,24.13 | U2.GND 17.78,24.13 | SV2.3 78.74,21.91 IC6.G_IN | J2.5 88.9,32.89 | 88.9,32.89 X5.8 | 88.9,32.89 88.88,32.87 83.54,32.87 82.54,33.87 80.48,33.87 v79.88,33.27 79.88,34.28 v79.87,34.29 | U4.4 71.98,15.24 72.08,15.34 73.66,15.34 74.65,16.33 74.65,17.15 76.2,18.7 SV2.5
  Bottom 1.27: C14.2 63.5,27.22 62.38,26.1 57.63,26.1 55.88,27.85 C15.2 | KEYBRD.4 11.11,20.32 15.35,16.08 15.52,16.08 16.37,15.23 16.37,15.06 S4.-
  pour Top: 0,63.5 99.69,63.5 99.69,0 0,0
  pour Top: 100.33,73.66 38.1,73.66 33.02,68.58 26.67,68.58 26.67,80.01 1.27,80.01 0,78.74 0,66.04 1.27,64.77 99.06,64.77 100.33,66.04
GND2
  Top 0.152: IC6.G_OUT 81.28,30.49 82.4,31.61 82.4,32.53 81.98,32.95 IC5.5 81.92,36.45 83.31,37.85 83.31,38.35 83.57,38.61 85.09,38.61 86.36,39.88 C17.2
  Top 0.305: SV1.2 93.59,48.82 93.59,47.13 92.39,45.94 SV1.5
  Bottom 0.152: 89.88,40.48 D2.3
  Bottom 0.305: SV1.2 | 89.88,40.48 89.88,43.56 91.41,45.09 SV1.5 | D2.3 87.14,40.49 C17.2
  Bottom 0.457: CAN_GND.1 95.06,51.44 | 95.06,51.44 95.06,50.31 SV1.2 | CON5.1 95.06,51.44
LEDS_K_SDA
  Top 0.152: KEYBRD.1 4.76,21.59 4.76,14.92 5.71,13.97 6.35,13.97 6.35,13.98 7.62,15.25 7.62,41.27 6.5,42.39 5.87,42.39 4.92,43.35 4.92,44.28 6.03,45.4 KEY_80.11
  Bottom 0.152: R12.2 14.6,46.99 13.72,47.87 11.43,47.87 11.03,47.47 7.84,47.47 6.72,46.35 KEY_80.11
MV_IN  (via drill 0.35)
  Top 0.152: SV3.4 80.16,4.92 82.26,4.92 82.4,5.05 82.4,7.02 81.81,7.6 81.81,10.45 85.09,13.73 85.09,22.35 87.97,25.22 87.97,27.21 88.51,27.76 89.84,27.76 90.68,26.92 91.95,26.92 93.53,28.51 93.53,32.64 89.59,36.59 89.59,38.66 90.83,39.9 90.83,61.92 91.14,62.23 91.14,77.78 90.17,78.74 32.66,78.74 INP.2 | v77.47,21.08 76.1,22.5 v76.07,22.73
  Bottom 0.152: SV3.4 77.78,3.49 76.66,2.38 72.87,2.38 69.68,5.56 69.06,5.56 68.1,6.52 68.1,7.62 73.18,12.7 76.2,12.7 77.53,14.03 X1.4 77.47,14.43 v77.47,21.08 | MINI_VERT.2 76.58,26.16 76.07,25.65 v76.07,22.73 | O1.2 37.19,69.65 33.53,69.65 28.65,74.52 INP.2
MV_OUT  (via drill 0.35)
  Top 0.152: v78.11,23.88 80.14,21.84 v80.14,21.72 | U4.2 54.93,16.83 54.93,15.87 55.09,15.7 55.09,14.78 54.44,14.12 53.49,14.12 52.86,13.49 52.86,12.11 53.51,11.46 54.59,11.46 56.24,9.8 56.24,9.79 57.52,8.51 58.81,8.51 59.33,7.99 59.33,6.71 61.85,4.19 66.43,4.19 68.11,5.87 69.68,5.87 71.81,8.01 71.81,10.45 73.13,11.77 74.23,11.77 v74.53,12.07
  Bottom 0.152: MINI_VERT.1 v78.11,23.88 | INP.4 28.5,72.24 28.5,73.15 27.43,74.22 27.43,75.13 28.19,75.89 34.44,75.89 36.88,73.46 38.1,73.46 38.74,74.1 38.74,75.12 42.36,78.74 90.17,78.74 91.11,77.8 91.11,73.5 | 91.11,73.5 91.11,57.66 93.84,54.93 97.47,54.93 97.79,54.61 97.79,39.76 95.07,37.04 95.07,34.27 93.87,33.06 93.87,31.82 94.6,31.08 94.6,28.79 92.3,26.49 91.06,26.49 90.07,25.5 89.91,25.5 89.69,25.29 86.69,25.29 84.26,22.86 81.28,22.86 v80.14,21.72 80.14,18.09 80.6,17.63 81.74,17.63 82.4,16.97 82.4,15.69 79.6,12.89 78.11,12.89 77.28,12.07 v74.53,12.07 | 91.11,73.5 87.78,73.5 O5.4
N$1
  Bottom 0.152: U2.TX0 27.94,16.51 29.21,15.24 29.52,15.24 29.79,15.52 30.53,15.52 33.6,12.45 39.64,12.45 40.33,11.76 42.86,11.76 43.55,12.45 47.34,12.45 52.55,7.23 52.55,4.29 53.51,3.33 54.44,3.33 55.09,3.98 55.09,4.93 IC3.5
N$2
  Top 0.305: X5.2 90.11,25.62 90.21,25.62 | X3.3 90.21,25.6 90.21,25.62 | X5.1 90.27,25.56 90.21,25.62
  Bottom 0.305: X5.2 89.91,27.84 89.91,34.86 89.32,35.45 86.38,35.45 85.85,34.92 85.85,34.51 85.03,33.69 83.88,33.69 82.88,34.68 81.42,34.68 80.72,35.38 80.72,35.56 80.54,35.74 SJ_SX3.1
N$3  (via drill 0.35)
  Top 0.152: U3.A5 35.56,35.81 34.92,35.17 34.54,35.17 34.02,34.66 34.02,33.6 34.14,33.48 34.14,32.56 32.31,30.73 32.21,30.73 32.21,27.58 32.94,26.85 32.94,25.86 32.21,25.12 32.21,23.04 32.77,22.47 36.66,22.47 38.86,20.27 43.54,20.27 44.15,19.66 v45.06,19.66
  Bottom 0.152: U3.A5 35.56,36.52 33.48,34.44 31.47,34.44 30.73,35.18 R9.1 | IC3.1 57.76,17.83 55.63,17.83 54.56,18.9 52.58,18.9 51.31,20.17 50.34,20.17 49.68,19.51 49.53,19.36 45.36,19.36 v45.06,19.66
N$4
  Top 0.152: S4.+ 15.24,14.29 15.24,22.86 R4.1
N$5  (via drill 0.35)
  Top 0.152: SV2.2 80.01,17.78 v73.66,17.78 | v46.99,11.43 47.78,11.43 v48.84,12.5
  Bottom 0.152: R10.1 24.84,24.08 26.06,22.86 26.06,20.32 26.04,20.3 26.04,12.92 27.39,11.56 30.39,11.56 30.97,12.14 39.51,12.14 40.2,11.46 42.99,11.46 43.67,12.14 46.28,12.14 v46.99,11.43 | v48.84,12.5 53.09,8.26 56.5,8.26 56.76,8.51 58.81,8.51 59.33,7.99 59.33,7.25 58.05,5.97 56.76,5.97 56.24,5.45 56.24,4.71 56.76,4.19 58.81,4.19 60.96,6.34 60.96,13.08 64.77,16.89 66.43,16.89 66.95,17.41 66.95,17.42 68.58,19.05 72.39,19.05 v73.66,17.78
N$6
  Top 0.152: S5.+ 24.13,13.97 22.23,15.88 R5.1
N$7
  Bottom 0.152: R6.1 32.32,18.16 36.83,18.16 40.32,14.67 S6.+
N$8
  Bottom 0.61: B1.AC1 47.95,61.92 57.77,61.92 58.1,61.59 X2.M X2.1
N$9  (via drill 0.35)
  Top 0.305: v83.97,37.97 84.67,37.97 87.19,35.45 89.32,35.45 89.9,34.86 89.9,33.29 91.29,31.9 91.86,31.9 92.45,31.31 92.45,30.09 91.44,29.09 X5.3
  Bottom 0.305: v83.97,37.97 83.16,37.97 82.41,37.22 80.44,37.22 SJ_SX4.1
N$10
  Bottom 0.152: SJ_SX6.1 43.25,25.47 IC2.7
N$11  (via drill 0.35)
  Top 0.152: IC3.10 65.41,8.24 66.95,9.79 66.95,11.43 66.95,13.69 65.72,14.92 IC3.13 59.7,15.24 58.81,14.35 55.75,14.35 R19.2 | v71.88,21.59 70.48,20.19 70.48,17.14 v70.54,17.09
  Bottom 0.152: U3.D9 52.42,47.91 52.42,44.2 54.2,42.42 54.2,35.32 55.88,33.64 55.88,33.02 56.08,32.82 56.96,32.82 57.68,32.09 57.68,31.18 58.69,30.18 65.33,30.18 65.73,29.77 65.73,25.13 65.3,24.7 65.3,23.36 65.91,22.76 70.71,22.76 v71.88,21.59 | v70.54,17.09 70.11,17.09 69.68,16.66 66.83,16.66 IC3.13
N$12
  Top 0.61: X2.2 43.5,59.37 B1.AC2 R8.2
N$14
  Bottom 0.152: Q1.2 60.17,37.75 58.42,39.5 R31.1
N$15  (via drill 0.35)
  Top 0.152: JP4.1 17.78,26.67 U2.RST 12.7,26.03 14.24,24.5 14.24,21.22 13.97,20.96 v13.97,20.32 | v39.37,9.86 39.37,10.02 40.09,10.74 40.09,11.56 39.51,12.14 34.74,12.14 27.83,19.05 v24.13,19.05
  Bottom 0.152: v13.97,20.32 15.24,19.05 v24.13,19.05 | v39.37,9.86 39.45,9.86 43.67,5.64 50.77,5.64 53.39,3.02 54.56,3.02 54.97,3.43 64.52,3.43 IC3.8
N$16  (via drill 0.35)
  Top 0.152: v53.98,22.23 52.91,23.29 52.91,24.57 53.34,25 v53.34,30.23
  Bottom 0.152: IC3.4 59.33,11.71 59.33,18.63 59.37,18.67 | U3.D5 52.7,37.47 52.7,32.31 52.73,32.28 52.73,30.84 v53.34,30.23 | v53.98,22.23 54.61,22.23 58.17,18.67 59.37,18.67 | R20.2 61.21,18.67 59.37,18.67
N$18
  Bottom 0.152: IC3.6 57.78,5.27 59.64,7.13 59.64,15.47 63.98,19.81 63.98,20.78 63.33,21.44 62.18,21.44 60.91,20.17 57.2,20.17 57.15,20.22 57.05,20.22 54.43,22.83 53.77,22.83 52.47,24.13 U3.RX1
N$19
  Bottom 0.152: R3.1 LED1.A
N$20  (via drill 0.35)
  Top 0.152: U3.D13 34.02,55.61 34.02,49.16 34.14,49.05 34.14,47.8 33.18,46.84 32.56,46.84 31.9,46.18 31.9,45.26 32.56,44.6 33.51,44.6 34.54,43.57 36.58,43.57 36.58,42.79 37.1,42.28 37.1,41.54 36.98,41.43 36.98,39.85 37.1,39.74 37.1,36.46 36.98,36.35 36.98,34.77 37.1,34.66 37.1,33.92 36.58,33.41 36.58,32.63 37.1,32.12 37.1,31.38 35.8,30.09 34.54,30.09 33.26,28.81 33.26,24.53 34.54,23.25 37.4,23.25 40.08,20.57 44.2,20.57 44.51,20.26 45.31,20.26 45.66,19.91 45.66,19.11 47.32,17.45 v47.32,15.67 | v55.87,12.69 56.76,11.81 60.07,11.81 60.96,12.7 IC3.12
  Bottom 0.152: U3.D13 34.61,56.2 25.08,56.2 JP3.1 | v47.32,15.67 51.97,15.67 53.51,14.12 54.45,14.12 v55.87,12.69
N$21  (via drill 0.35)
  Top 0.152: v44.45,47.31 OK1.2 43.18,52.07 40.64,52.07 R8.1
  Bottom 0.152: v44.45,47.31 43.31,47.31 NO_OPTO.2
N$22
  Bottom 0.152: O3.4 67,72.12 68.12,73.24 72.86,73.24 O4.2
N$24  (via drill 0.35)
  Top 0.152: v2.86,50.8 2.86,50.28 2.07,49.49 2.07,45.76 2.38,45.45 2.38,40.81 3.03,40.16 4.29,40.16 4.92,39.53 4.92,32.67 6.03,31.55 KEYBRD.2
  Bottom 0.152: v2.86,50.8 2.95,50.8 3.56,51.41 5.02,51.41 5.69,52.07 7.62,52.07 8.64,52.07 R15.2 11.16,54.6 11.16,55.61 11.16,55.88 11.16,57.52 11.68,58.03 13.34,58.03 14.12,58.82 14.12,61.67 14.94,62.48 61.34,62.48 64.92,58.9 64.92,57.32 65.58,56.67 66.9,56.67 68.04,55.52 69.83,55.52 71.38,53.98 76.2,53.98 76.99,54.76 78.89,54.76 79.54,55.42 79.54,56.34 78.42,57.46 KEYBRD_1.1
N$25  (via drill 0.35)
  Top 0.152: KEYBRD.8 7.3,16.51 7.3,30.73 | v3.81,50.8 2.54,49.53 2.54,49.52 2.38,49.36 2.38,45.88 3.33,44.93 3.96,44.93 4.61,44.28 4.61,41.12 5.57,40.16 6.19,40.16 7.3,39.05 7.3,30.73 | v7.01,30.73 7.3,30.73 | KEYBRD_1.5 78.42,53.78 72.15,60.05 68.98,60.05 67.58,61.44 65.56,61.44 61.16,57.05 54.51,57.05 53.09,55.63 52.48,55.63 51.84,56.27 48.7,56.27 v48.34,55.91
  Bottom 0.152: v3.81,50.8 4.85,50.8 5.81,51.77 10.02,51.77 11.98,53.73 13.72,53.73 14.29,54.29 14.29,55.56 14.99,56.27 24.58,56.27 24.96,55.89 26.02,55.89 26.4,55.51 26.4,54.24 26.99,53.66 36.51,53.66 37.15,54.29 37.15,54.93 38.43,56.21 48.08,56.21 48.34,55.96 v48.34,55.91 | KEY_A7.2 v7.01,30.73
N$27  (via drill 0.35)
  Top 0.152: v42.52,38.25 41.91,38.86 41.91,40.95 43.18,42.22 43.18,44.45 44.15,45.41 44.45,45.41 46.02,46.99 48.9,46.99 49.78,47.87 51.82,47.87 52.7,46.99 54.25,46.99 v54.4,46.84
  Bottom 0.152: U2.A6 13.97,35.56 15.56,35.56 17.94,33.18 18.47,33.18 18.86,32.79 22.85,32.79 23.46,33.41 29.46,33.41 30.97,31.9 33.48,31.9 34.99,33.41 36.58,33.41 37.1,33.92 37.1,34.98 36.98,35.1 36.98,36.35 38.89,38.25 v42.52,38.25 | v54.4,46.84 54.46,46.84 57.78,50.16 62.87,50.16 64.85,48.18 73.58,48.18 73.66,48.26 | 73.66,48.26 C7.1 79.69,49.53 KEYBRD_1.8 | 73.66,48.26 R14.1
N$28  (via drill 0.35)
  Top 0.152: v72.79,21.59 71.18,19.98 v71.18,16.45
  Bottom 0.152: JP4.2 22.47,52.95 32.45,52.95 34.92,50.48 36.51,50.48 37.78,49.21 47.94,49.21 U3.D10 52.73,50.14 52.73,44.32 56.84,40.22 56.84,37.63 56.76,37.55 56.76,35.15 57.99,33.93 57.99,31.31 58.62,30.68 65.84,30.68 66.04,30.48 66.04,25 65.61,24.57 65.61,23.69 66.23,23.06 71.32,23.06 v72.79,21.59 | v71.18,16.45 71.08,16.36 68.75,16.36 68.1,15.7 68.1,12.7 68.1,12.42 68.1,10.94 65.67,8.51 64.38,8.51 63.86,7.99 63.86,7.25 65.41,5.7 IC3.9
N$31
  Top 0.152: U3.TX0 50.9,21.49 50.9,21.18 53.19,18.9 54.56,18.9 57.76,15.7 57.76,15.24 IC3.2
N$33
  Bottom 0.152: R2.1 43.28,19.05 43.59,18.75 49.52,18.75 50.34,17.93 52.24,17.93 53.51,16.66 55.24,16.66 56.24,15.67 56.24,14.25 IC3.3
N$34
  Bottom 0.152: U2.RX1 29.21,24.13 33.07,20.27 43.59,20.27 44.81,19.05 R2.2
N$35
  Bottom 0.152: O2.2 46.94,69.65 41.45,69.65 40.23,70.87 38.56,70.87 37.34,72.08 O1.4
N$37
  Bottom 0.152: O4.4 77.16,72.12 78.28,73.24 82.66,73.24 O5.2
N$38
  Top 0.152: R23.1 IC2.2 45.72,30.48 45.72,26.98 44.6,25.86 44.6,25.24 43.49,24.13 41.91,24.13 IC2.6
  Bottom 0.152: R24.2 R23.1
N$39
  Top 0.152: R30.1 43.18,37.14 42.06,36.02 42.06,34.44 IC2.3
  Bottom 0.152: R25.1 57.76,21.59 57.76,24.54 53.85,28.45 53.85,29.21 53.44,29.62 53.09,29.62 52.43,30.28 52.43,32.16 52.4,32.18 52.4,35.23 52.07,35.56 49.84,35.56 48.72,34.44 48.46,34.44 48.26,34.44 42.06,34.44 IC2.3 40.01,33.02 38.54,31.55 SJ_SX1.1 | R29.2 R30.1
N$40
  Bottom 0.457: 77.78,30.86 77.84,30.8 82.55,30.8 83.13,31.38 87.56,31.38 88.37,30.57 88.37,29.9 X5.4 | SJ_SX5.1 76.83,37.59 77.08,37.34 77.63,37.34 77.85,37.12 77.85,35.27 77.78,35.2 77.78,30.86 | 77.78,30.86 77.78,30.1 78.11,29.77 SJ_LN1.1
N$42
  Top 0.152: IC2.5 39.37,24.13 R28.1
  Bottom 0.152: SJ_SX2.1 38.54,25.84 IC2.5
N$58
  Bottom 0.152: O3.2 66.67,70.54 65.56,71.66 65.56,75.41 63.5,77.47 49.53,77.47 48.19,76.13 48.19,74.2 47.08,73.08 O2.4
OSC1
  Top 0.152: C15.1 58.37,28.04 58.37,29.26 56.52,31.11 IC4.8 55.09,33.18 X6.2
OSC2
  Top 0.152: X6.1 55.09,37.38 56.28,36.18 56.28,34.7 59.05,31.93 IC4.7 59.05,30.86 59.56,30.35 60.96,28.96 C14.1
PE
  Top 0.152: X3.PE 97.07,27.6 97.07,32.48 X3.PE@
POWER2
  Top 1.016: O5.6 83.5,77.47 76.52,77.47 | 47.08,77.47 40.13,77.47 O1.6 36.2,74.66 31.11,69.58 INP.6 | 47.08,77.47 56.84,77.47 66.67,77.47 | 66.67,77.47 76.52,77.47 | O4.6 76.52,77.47 | O3.6 66.67,77.47 | O2.6 47.08,77.47
  Bottom 0.61: J3.2 17.78,73.6
  Bottom 1.016: X7.2 13.69,75.39 13.69,74.82 14.92,73.6 17.78,73.6 18.46,73.6 22.34,77.47 34.29,77.47 37.1,74.66 O1.6
  pour Top: 100.33,74.3 38.1,74.3 36.2,72.39 33.02,69.22 27.3,69.22 27.3,79.38 27.94,80.01 100.33,80.01
  pour Bottom: 0,72.39 21.59,72.39 22.23,73.03 22.23,74.3 22.86,74.93 23.5,75.56 26.04,75.56 34.92,75.56 36.83,73.66 37.47,73.66 38.73,73.66 38.73,75.56 38.73,80.01 0,80.01
RESET_K  (via drill 0.35)
  Top 0.152: v25.08,43.18 24.75,43.51 24.75,45.12 24.13,45.74 24.13,49.53 R3.2 25.45,50.9 25.45,56.69 30.94,62.18 48.31,62.18 48.74,61.75 67.71,61.75 69.11,60.35 72.28,60.35 75.63,57 78.89,57 79.84,56.04 79.84,55.42 80.96,54.3 KEYBRD_1.6 | U2.A3 10.16,41.91 9.41,41.16 9.41,27.95 10.13,27.23 10.13,26.62 8.57,25.06 v8.57,18.41
  Bottom 0.152: KEY_80.10 4.76,42.55 12.06,42.55 U2.A3 13.97,43.18 v25.08,43.18 | KEYBRD.6 6.67,18.41 v8.57,18.41
RXCAN
  Top 0.152: IC4.2 73.03,30.48 76.2,30.48 76.73,31.01 76.73,37.56 74.3,40 IC5.2 72.92,42.33 71.02,42.33 70.33,43.01 70.33,44.45 69.29,45.49 62.83,45.49 62.58,45.24 60.61,45.24 60.48,45.37 60.48,49.36 62.23,51.11 CAN2.11
SCL
  Top 0.152: 14.29,36.83 U2.A5 | 14.29,36.83 R27.1 C9.1 | KEY_80.12 4.61,47.47 5.08,47.47 5.38,47.78 6.5,47.78 7.3,48.58 7.3,49.21 7.62,49.53 9.65,49.53 10.16,49.02 R15.1 10.16,45.09 10.79,44.45 10.79,43.18 11.18,42.79 13.72,42.79 14.29,42.23 14.29,36.83
SDA
  Bottom 0.152: R12.1 U2.A4
SX_POWER_INP  (via drill 0.35)
  Top 0.61: C2.1 67.94,60.33 IC1.IN 72.39,59.05 77.08,54.37 77.08,44.21 v78.11,43.18
  Top 0.762: C4.1 58.98,56.44 61.42,56.44 65.3,60.33 C2.1 | B1.+ 46.91,58.34 51.95,58.34 52.73,57.55 v52.73,56.24
  Bottom 0.406: 78.11,37.91
  Bottom 0.61: D1.C 71.12,59.05 IC1.IN | SJ_SX3.2 78.11,37.91 v78.11,43.18
  Bottom 0.762: C4.1 53.02,55.56 52.73,55.85 v52.73,56.24
SX_T0
  Top 0.152: X3.1 87.01,37.66 87.75,37.66 91.44,33.97 J2.6
  Bottom 0.152: R28.2 45.72,22.86 46.84,23.98 46.84,26.52 47.14,26.82 48.72,26.82 49.84,27.94 53.92,27.94 55.45,26.42 55.45,22.35 57.32,20.47 60.79,20.47 62.06,21.74 64.36,21.74 64.67,21.44 69.68,21.44 70.33,20.78 70.33,20.73 70.48,20.57 76.1,20.57 80.01,24.48 80.01,25.4 80.39,25.78 81.65,25.78 82.24,26.36 85.51,26.36 85.81,26.06 87.92,26.06 88.39,25.59 89.57,25.59 90.77,26.79 92.17,26.79 94.21,28.82 94.21,30.95 91.98,33.18 J2.6
SX_T1
  Top 0.152: J2.4 91.44,30.86 89.16,33.14 87.63,33.14 85.68,35.08 X3.4
  Bottom 0.152: R25.2 60.78,22.05 64.77,22.05 65.08,21.74 69.85,21.74 70.71,20.88 75.98,20.88 79.7,24.61 79.7,27.69 79.76,27.74 | Q1.3 61.44,38.27 62.38,39.21 62.38,42.5 61.59,43.29 61.59,44.2 62.03,44.63 62.83,44.63 63.39,45.19 74.41,45.19 75.09,45.87 84.94,45.87 85.09,45.72 85.09,40.45 84.26,39.62 84.26,39.12 85.09,38.29 85.09,35.72 X3.4 | J2.4 91.44,29.42 90.51,28.48 90.51,27.12 89.29,25.9 88.51,25.9 88.05,26.36 85.94,26.36 85.63,26.67 83.19,26.67 81.75,28.11 80.82,28.11 80.46,27.74 79.76,27.74 | SJ_LN1.2 79.76,27.74
TXCAN
  Top 0.152: CAN2.10 60.17,51.59 60.17,45.24 60.48,44.93 66.52,44.93 66.58,44.99 67.79,43.78 67.79,43.01 68.48,42.33 69.24,42.33 70.33,41.24 70.33,40.47 71.22,39.59 73.13,39.59 IC5.3 75.44,38.42 76.43,37.43 76.43,32.11 76.07,31.75 IC4.1

## Text on the board
Top: Top | GND
Bottom: Bot | +5V
tPlace: +
bPlace: https://wiki.mobaledlib.de | https://www.stummiforum.de/viewtopic.php?f=7&t=165060 | https://www.stummiforum.de/viewtopic.php?f=7&t=165060 | https://wiki.mobaledlib.de | by Hardi und Jürgen (fromue) | Main Module
tNames: Ver.: | + | - | Opt. | Input | - | 5V | + | by Hardi u. / Jürgen | Mini- / distributor | DCC | Mä-CAN | 1N4148 | DCC | DCC Nano | CAN | LEDs Main / Module | LED Nano | Selectrix | GND +5V | GND +5V | + | => | <= | L+R / =All | + | Long / =ESC | + | LED N | LED 0 | LED / Test | Sim / Inp. | Inp. / Test | by Hardi | MobaLedLib
bNames: + | Opt | - | by Hardi u. / Jürgen / (fromue) | Mini- / distributor | MobaLedLib | by Hardi | 5V | - | + | <- für Alf | -Arduino_fuer_LEDs | 101a- | by Hardi | MobaLedLib
Name: 1 LN | 2 LN | 2 SX | 1 SX